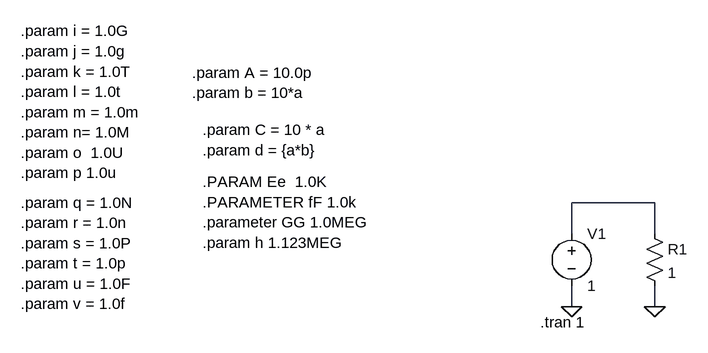
[diagram p0: schematic test7.asc]
test7.asc, the LTspice schematic file:
Version 4
SHEET 1 880 680
WIRE 208 96 80 96
WIRE 80 144 80 96
WIRE 208 144 208 96
WIRE 80 256 80 224
WIRE 208 256 208 224
FLAG 80 256 0
FLAG 208 256 0
SYMBOL voltage 80 128 R0
SYMATTR InstName V1
SYMATTR Value 1
SYMBOL res 192 128 R0
SYMATTR InstName R1
SYMATTR Value 1
TEXT 32 280 Left 2 !.tran 1
TEXT -504 -104 Left 2 !.param A = 10.0p\n.param b = 10*a
TEXT -488 -16 Left 2 !.param C = 10 * a\n.param d = {a*b}
TEXT -488 64 Left 2 !.PARAM Ee  1.0K\n.PARAMETER fF 1.0k\n.parameter GG 1.0MEG\n.param h 1.123MEG
TEXT -768 -168 Left 2 !.param i = 1.0G\n.param j = 1.0g\n.param k = 1.0T\n.param l = 1.0t\n.param m = 1.0m\n.param n= 1.0M\n.param o  1.0U\n.param p 1.0u
TEXT -768 96 Left 2 !.param q = 1.0N\n.param r = 1.0n\n.param s = 1.0P\n.param t = 1.0p\n.param u = 1.0F\n.param v = 1.0f

The netlist it stands for:
* test7.asc
V1 N001 0 1
R1 N001 0 1
.tran 1
.param A = 10.0p
.param b = 10*a
.param C = 10 * a
.param d = {a*b}
.PARAM Ee  1.0K
.PARAMETER fF 1.0k
.parameter GG 1.0MEG
.param h 1.123MEG
.param i = 1.0G
.param j = 1.0g
.param k = 1.0T
.param l = 1.0t
.param m = 1.0m
.param n= 1.0M
.param o  1.0U
.param p 1.0u
.param q = 1.0N
.param r = 1.0n
.param s = 1.0P
.param t = 1.0p
.param u = 1.0F
.param v = 1.0f
.backanno
.end